# Altium schematic sheet Temp_Sensor.SchDoc: =SheetTitle
size A4; DrawnBy: Samyar Sadat Akhavi; SheetNumber: 19; SheetTotal: 19; SheetTitle: Board Temperature Sensor
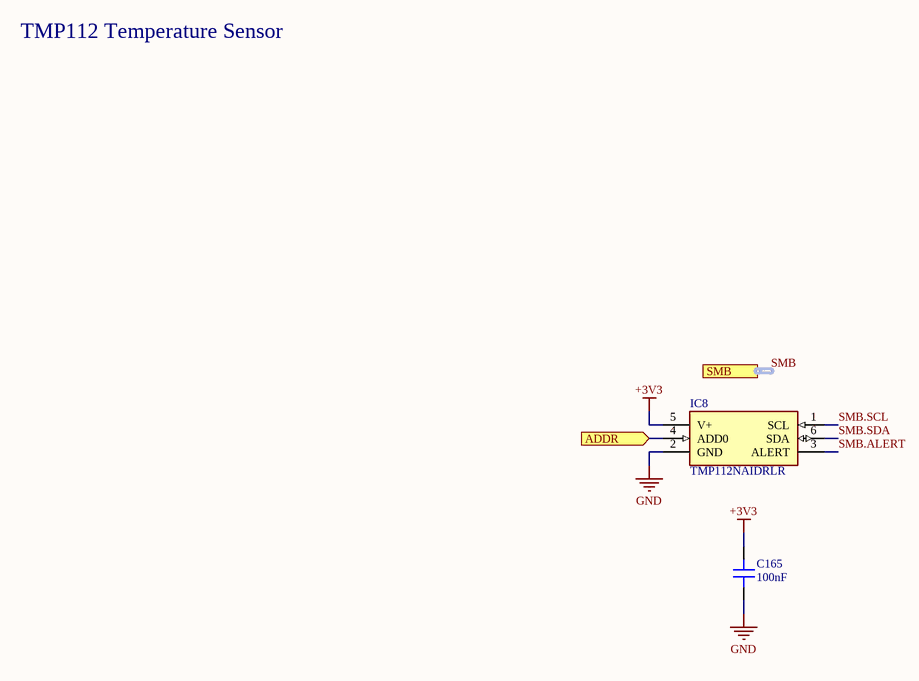
[diagram p0: Temp_Sensor.SchDoc]

## Parts
?  (no value)  (graphical)
C165  100nF  [CAP 0603_1608]
IC8  TMP112NAIDRLR  [SOTFL50P160X60-6N]

## Ports
ADDR (in, see Voltage_Regulators[4D]), SMB (harness SMBus, see Power_Board[3B], Power_Measurement[3B], Voltage_Reg_12V[2C], Voltage_Reg_SBC[1B])

## Nets
+3V3: C165.1 IC8.5(V+)
GND: C165.2 IC8.2(GND)
ADDR: IC8.4(ADD0) ; port ADDR
SMB.ALERT: IC8.3(ALERT)
SMB.SCL: IC8.1(SCL)
SMB.SDA: IC8.6(SDA)

## Buses and harness runs
harness SMB = port SMB

## Notes on the sheet
- TMP112 Temperature Sensor
- Sub-Project:
- Size:
- Drawn By:
- Revision:
- Date:
- File:
- Sheet:
- of

## Library data of the parts
? = SGR-STDTBSA4: STANDARD SCHEMATICS TITLE BLOCK
C165 = GEN-CC100NT10V50KX7R603: GENERIC 0603 MLC CAPACITOR; Tolerance: ±10%; Voltage: 50V; Dielectric: X7R; Part Number: GEN-CC100NT10V50KX7R603; Value: 100nF
IC8 = TMP112NAIDRLR: SENSOR DIGITAL -40C-125C SOT563; Manufacturer: Texas Instruments; Part Number: TMP112NAIDRLR; Supplier 1: DigiKey; Supplier Part Number 1: 296-50015-1-ND